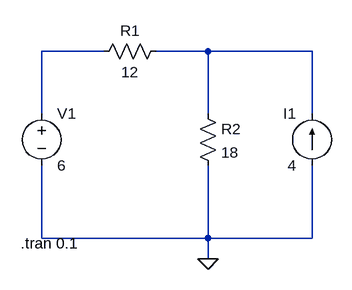
[diagram p0: schematic exam question.asc]
exam question.asc, the LTspice schematic file:
Version 4
SHEET 1 880 680
WIRE 192 0 96 0
WIRE 352 0 272 0
WIRE 512 0 352 0
WIRE 96 96 96 0
WIRE 352 96 352 0
WIRE 512 96 512 0
WIRE 96 288 96 176
WIRE 352 288 352 176
WIRE 352 288 96 288
WIRE 512 288 512 176
WIRE 512 288 352 288
WIRE 352 320 352 288
FLAG 352 320 0
SYMBOL voltage 96 80 R0
WINDOW 123 0 0 Left 2
WINDOW 39 0 0 Left 2
SYMATTR InstName V1
SYMATTR Value 6
SYMBOL res 288 -16 R90
WINDOW 0 0 56 VBottom 2
WINDOW 3 32 56 VTop 2
SYMATTR InstName R1
SYMATTR Value 12
SYMBOL res 336 80 R0
SYMATTR InstName R2
SYMATTR Value 18
SYMBOL current 512 176 R180
WINDOW 0 24 80 Left 2
WINDOW 3 24 0 Left 2
WINDOW 123 0 0 Left 2
WINDOW 39 0 0 Left 2
SYMATTR InstName I1
SYMATTR Value 4
TEXT 64 296 Left 2 !.tran 0.1

The netlist it stands for:
* exam question.asc
V1 N001 0 6
R1 N002 N001 12
R2 N002 0 18
I1 0 N002 4
.tran 0.1
.backanno
.end